# Altium schematic sheet FPGA-6.SchDoc
size A3; Date: Date; CompanyName: HESSO; Engineer: Name; Address1: Route du Rawyl 47; Address2: 1950 Sion; Address3: Switzerland; ProjectName: Project Name
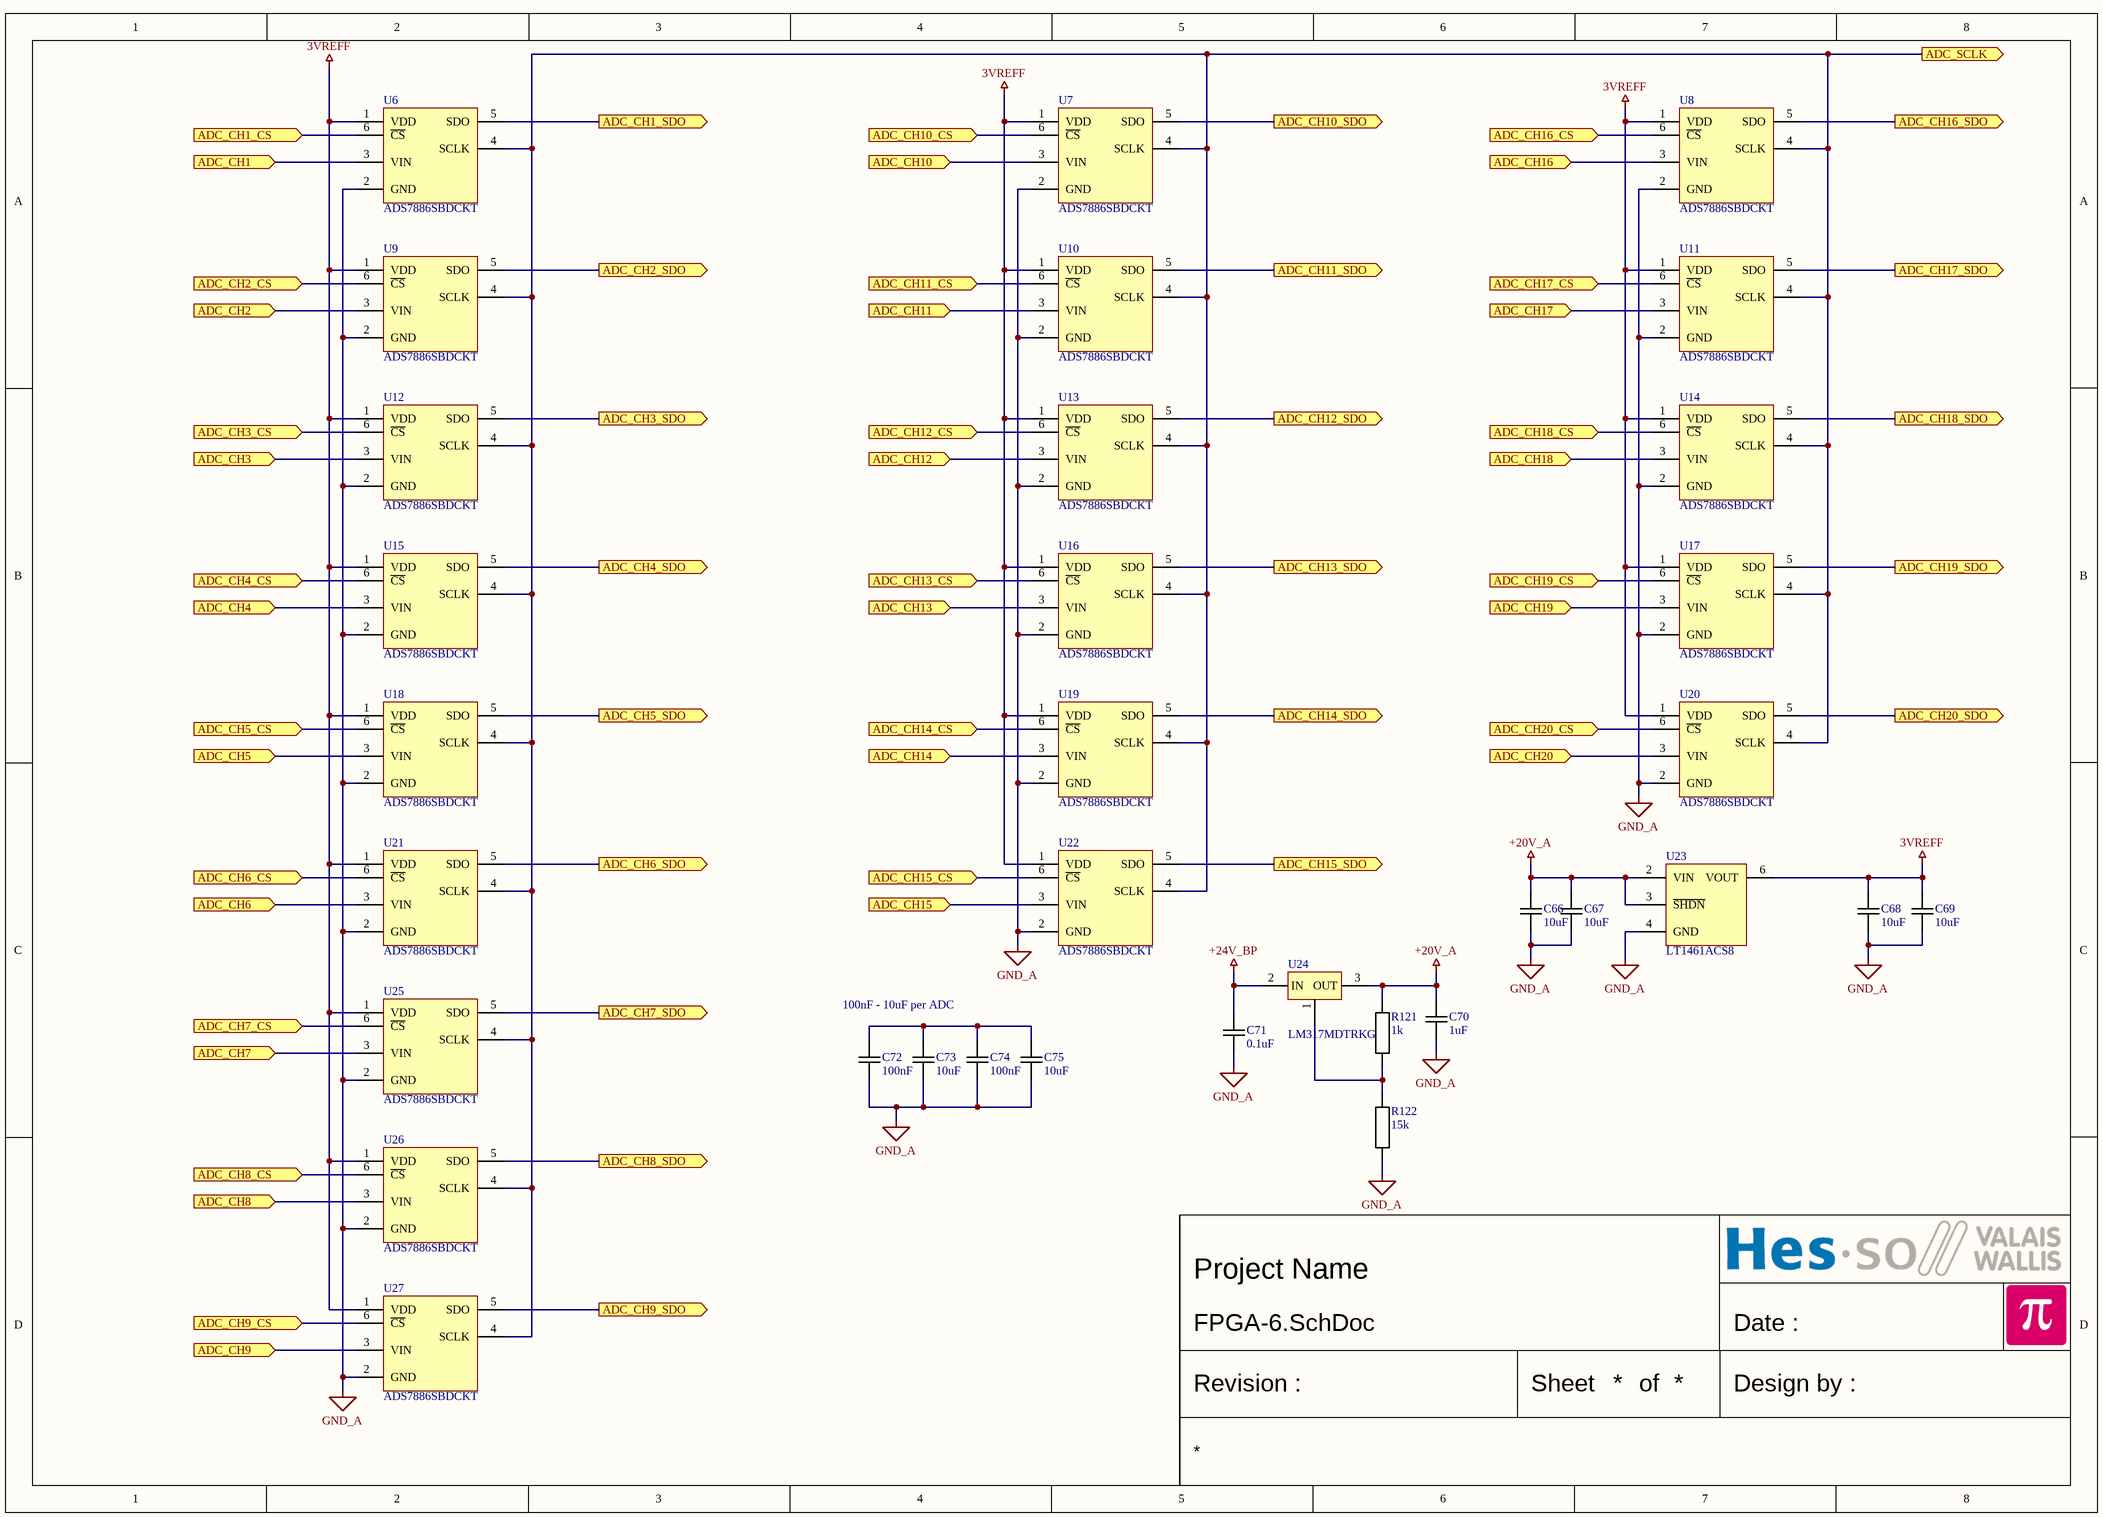
[diagram p0: FPGA-6.SchDoc]

## Parts
C66  10uF  [CAPACITOR 1608 REFLOW]
C67  10uF  [CAPACITOR 1608 REFLOW]
C68  10uF  [CAPACITOR 1608 REFLOW]
C69  10uF  [CAPACITOR 1608 REFLOW]
C70  1uF  [CAPACITOR 1608 REFLOW]
C71  0.1uF  [CAPACITOR 1608 REFLOW]
C72  100nF  [CAPACITOR 1005 REFLOW]
C73  10uF  [CAPACITOR 1608 REFLOW]
C74  100nF  [CAPACITOR 1005 REFLOW]
C75  10uF  [CAPACITOR 1608 REFLOW]
R121  1k  [RESISTOR 1608 REFLOW]
R122  15k  [RESISTOR 1608 REFLOW]
U6  ADS7886SBDCKT  [SOT23-6 P0.95 C1.5x3.0 H1.3]
U7  ADS7886SBDCKT  [SOT23-6 P0.95 C1.5x3.0 H1.3]
U8  ADS7886SBDCKT  [SOT23-6 P0.95 C1.5x3.0 H1.3]
U9  ADS7886SBDCKT  [SOT23-6 P0.95 C1.5x3.0 H1.3]
U10  ADS7886SBDCKT  [SOT23-6 P0.95 C1.5x3.0 H1.3]
U11  ADS7886SBDCKT  [SOT23-6 P0.95 C1.5x3.0 H1.3]
U12  ADS7886SBDCKT  [SOT23-6 P0.95 C1.5x3.0 H1.3]
U13  ADS7886SBDCKT  [SOT23-6 P0.95 C1.5x3.0 H1.3]
U14  ADS7886SBDCKT  [SOT23-6 P0.95 C1.5x3.0 H1.3]
U15  ADS7886SBDCKT  [SOT23-6 P0.95 C1.5x3.0 H1.3]
U16  ADS7886SBDCKT  [SOT23-6 P0.95 C1.5x3.0 H1.3]
U17  ADS7886SBDCKT  [SOT23-6 P0.95 C1.5x3.0 H1.3]
U18  ADS7886SBDCKT  [SOT23-6 P0.95 C1.5x3.0 H1.3]
U19  ADS7886SBDCKT  [SOT23-6 P0.95 C1.5x3.0 H1.3]
U20  ADS7886SBDCKT  [SOT23-6 P0.95 C1.5x3.0 H1.3]
U21  ADS7886SBDCKT  [SOT23-6 P0.95 C1.5x3.0 H1.3]
U22  ADS7886SBDCKT  [SOT23-6 P0.95 C1.5x3.0 H1.3]
U23  LT1461ACS8  [SO8 P1.27 C4.0X5.0 H1.75]
U24  LM317MDTRKG  [TO252-2 P2.29 C6.2x6.7 H2.4]
U25  ADS7886SBDCKT  [SOT23-6 P0.95 C1.5x3.0 H1.3]
U26  ADS7886SBDCKT  [SOT23-6 P0.95 C1.5x3.0 H1.3]
U27  ADS7886SBDCKT  [SOT23-6 P0.95 C1.5x3.0 H1.3]

## Ports
ADC_CH1 (in), ADC_CH1_CS (in), ADC_CH1_SDO (out), ADC_CH2 (in), ADC_CH2_CS (in), ADC_CH2_SDO (out), ADC_CH3 (in), ADC_CH3_CS (in), ADC_CH3_SDO (out), ADC_CH4 (in), ADC_CH4_CS (in), ADC_CH4_SDO (out), ADC_CH5 (in), ADC_CH5_CS (in), ADC_CH5_SDO (out), ADC_CH6 (in), ADC_CH6_CS (in), ADC_CH6_SDO (out), ADC_CH7 (in), ADC_CH7_CS (in), ADC_CH7_SDO (out), ADC_CH8 (in), ADC_CH8_CS (in), ADC_CH8_SDO (out), ADC_CH9 (in), ADC_CH9_CS (in), ADC_CH9_SDO (out), ADC_CH10 (in), ADC_CH10_CS (in), ADC_CH10_SDO (out), ADC_CH11 (in), ADC_CH11_CS (in), ADC_CH11_SDO (out), ADC_CH12 (in), ADC_CH12_CS (in), ADC_CH12_SDO (out), ADC_CH13 (in), ADC_CH13_CS (in), ADC_CH13_SDO (out), ADC_CH14 (in), ADC_CH14_CS (in), ADC_CH14_SDO (out), ADC_CH15 (in), ADC_CH15_CS (in), ADC_CH15_SDO (out), ADC_CH16 (in), ADC_CH16_CS (in), ADC_CH16_SDO (out), ADC_CH17 (in), ADC_CH17_CS (in), ADC_CH17_SDO (out), ADC_CH18 (in), ADC_CH18_CS (in), ADC_CH18_SDO (out), ADC_CH19 (in), ADC_CH19_CS (in), ADC_CH19_SDO (out), ADC_CH20 (in), ADC_CH20_CS (in), ADC_CH20_SDO (out), ADC_SCLK (out)

## Nets
3VREFF: C68.2 C69.2 U6.1(VDD) U7.1(VDD) U8.1(VDD) U9.1(VDD) U10.1(VDD) U11.1(VDD) U12.1(VDD) U13.1(VDD) U14.1(VDD) U15.1(VDD) U16.1(VDD) U17.1(VDD) U18.1(VDD) U19.1(VDD) U20.1(VDD) U21.1(VDD) U22.1(VDD) U23.6(VOUT) U25.1(VDD) U26.1(VDD) U27.1(VDD)
+20V_A: C66.2 C67.2 C70.2 R121.2 U23.2(VIN) U23.3(~{SHDN}) U24.3(OUT)
+24V_BP: C71.2 U24.2(IN)
GND_A: C66.1 C67.1 C68.1 C69.1 C70.1 C71.1 C72.2 C73.2 C74.2 C75.2 R122.1 U6.2(GND) U7.2(GND) U8.2(GND) U9.2(GND) U10.2(GND) U11.2(GND) U12.2(GND) U13.2(GND) U14.2(GND) U15.2(GND) U16.2(GND) U17.2(GND) U18.2(GND) U19.2(GND) U20.2(GND) U21.2(GND) U22.2(GND) U23.4(GND) U25.2(GND) U26.2(GND) U27.2(GND)
ADC_CH1: U6.3(VIN) ; port ADC_CH1
ADC_CH1_CS: U6.6(~{CS}) ; port ADC_CH1_CS
ADC_CH1_SDO: U6.5(SDO) ; port ADC_CH1_SDO
ADC_CH2: U9.3(VIN) ; port ADC_CH2
ADC_CH2_CS: U9.6(~{CS}) ; port ADC_CH2_CS
ADC_CH2_SDO: U9.5(SDO) ; port ADC_CH2_SDO
ADC_CH3: U12.3(VIN) ; port ADC_CH3
ADC_CH3_CS: U12.6(~{CS}) ; port ADC_CH3_CS
ADC_CH3_SDO: U12.5(SDO) ; port ADC_CH3_SDO
ADC_CH4: U15.3(VIN) ; port ADC_CH4
ADC_CH4_CS: U15.6(~{CS}) ; port ADC_CH4_CS
ADC_CH4_SDO: U15.5(SDO) ; port ADC_CH4_SDO
ADC_CH5: U18.3(VIN) ; port ADC_CH5
ADC_CH5_CS: U18.6(~{CS}) ; port ADC_CH5_CS
ADC_CH5_SDO: U18.5(SDO) ; port ADC_CH5_SDO
ADC_CH6: U21.3(VIN) ; port ADC_CH6
ADC_CH6_CS: U21.6(~{CS}) ; port ADC_CH6_CS
ADC_CH6_SDO: U21.5(SDO) ; port ADC_CH6_SDO
ADC_CH7: U25.3(VIN) ; port ADC_CH7
ADC_CH7_CS: U25.6(~{CS}) ; port ADC_CH7_CS
ADC_CH7_SDO: U25.5(SDO) ; port ADC_CH7_SDO
ADC_CH8: U26.3(VIN) ; port ADC_CH8
ADC_CH8_CS: U26.6(~{CS}) ; port ADC_CH8_CS
ADC_CH8_SDO: U26.5(SDO) ; port ADC_CH8_SDO
ADC_CH9: U27.3(VIN) ; port ADC_CH9
ADC_CH9_CS: U27.6(~{CS}) ; port ADC_CH9_CS
ADC_CH9_SDO: U27.5(SDO) ; port ADC_CH9_SDO
ADC_CH10: U7.3(VIN) ; port ADC_CH10
ADC_CH10_CS: U7.6(~{CS}) ; port ADC_CH10_CS
ADC_CH10_SDO: U7.5(SDO) ; port ADC_CH10_SDO
ADC_CH11: U10.3(VIN) ; port ADC_CH11
ADC_CH11_CS: U10.6(~{CS}) ; port ADC_CH11_CS
ADC_CH11_SDO: U10.5(SDO) ; port ADC_CH11_SDO
ADC_CH12: U13.3(VIN) ; port ADC_CH12
ADC_CH12_CS: U13.6(~{CS}) ; port ADC_CH12_CS
ADC_CH12_SDO: U13.5(SDO) ; port ADC_CH12_SDO
ADC_CH13: U16.3(VIN) ; port ADC_CH13
ADC_CH13_CS: U16.6(~{CS}) ; port ADC_CH13_CS
ADC_CH13_SDO: U16.5(SDO) ; port ADC_CH13_SDO
ADC_CH14: U19.3(VIN) ; port ADC_CH14
ADC_CH14_CS: U19.6(~{CS}) ; port ADC_CH14_CS
ADC_CH14_SDO: U19.5(SDO) ; port ADC_CH14_SDO
ADC_CH15: U22.3(VIN) ; port ADC_CH15
ADC_CH15_CS: U22.6(~{CS}) ; port ADC_CH15_CS
ADC_CH15_SDO: U22.5(SDO) ; port ADC_CH15_SDO
ADC_CH16: U8.3(VIN) ; port ADC_CH16
ADC_CH16_CS: U8.6(~{CS}) ; port ADC_CH16_CS
ADC_CH16_SDO: U8.5(SDO) ; port ADC_CH16_SDO
ADC_CH17: U11.3(VIN) ; port ADC_CH17
ADC_CH17_CS: U11.6(~{CS}) ; port ADC_CH17_CS
ADC_CH17_SDO: U11.5(SDO) ; port ADC_CH17_SDO
ADC_CH18: U14.3(VIN) ; port ADC_CH18
ADC_CH18_CS: U14.6(~{CS}) ; port ADC_CH18_CS
ADC_CH18_SDO: U14.5(SDO) ; port ADC_CH18_SDO
ADC_CH19: U17.3(VIN) ; port ADC_CH19
ADC_CH19_CS: U17.6(~{CS}) ; port ADC_CH19_CS
ADC_CH19_SDO: U17.5(SDO) ; port ADC_CH19_SDO
ADC_CH20: U20.3(VIN) ; port ADC_CH20
ADC_CH20_CS: U20.6(~{CS}) ; port ADC_CH20_CS
ADC_CH20_SDO: U20.5(SDO) ; port ADC_CH20_SDO
ADC_SCLK: U6.4(SCLK) U7.4(SCLK) U8.4(SCLK) U9.4(SCLK) U10.4(SCLK) U11.4(SCLK) U12.4(SCLK) U13.4(SCLK) U14.4(SCLK) U15.4(SCLK) U16.4(SCLK) U17.4(SCLK) U18.4(SCLK) U19.4(SCLK) U20.4(SCLK) U21.4(SCLK) U22.4(SCLK) U25.4(SCLK) U26.4(SCLK) U27.4(SCLK) ; port ADC_SCLK
NetC72_1: C72.1 C73.1 C74.1 C75.1
NetR121_1: R121.1 R122.2 U24.1(GND)

## Notes on the sheet
- 100nF - 10uF per ADC
- Date :
- Revision :
- Sheet
- of
- Design by :

## Library data of the parts
C66-C75 = Capacitor
  C66-C69 C73 C75: Value: 10uF
  C70: Value: 1uF
  C71: Value: 0.1uF
  C72 C74: Value: 100nF
R121 R122 = Resistor: Resistor 1% 50V 100mW 1608(0603)
  R121: Value: 1k
  R122: Value: 15k
U6-U22 U25-U27 = ADS7886SBDCKT: 12-Bit, 1-MSPS, Micro-Power, Miniature SAR Analog-to-Digital Converters; Value: ADS7886SBDCKT
U23 = LT1461ACS8: Micropower Precision Low Dropout Series Voltage Reference Family; Value: LT1461ACS8
U24 = REGPOS TO252-2 GND,VIN,OUT: Generic Positive Voltage Regulator; Value: LM317MDTRKG